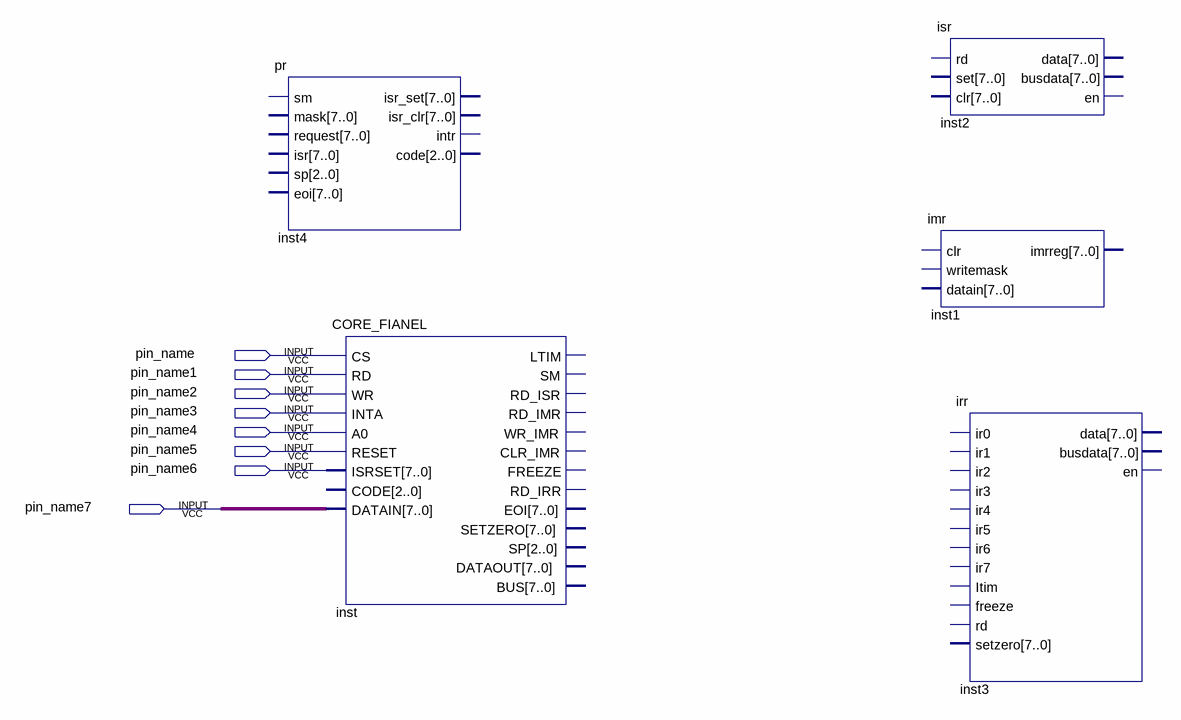
[diagram p0: schematic sheet]
// Quartus schematic 8259A_down.bdf as structural Verilog: 5 symbols, 8 pins
module \8259A_down  (
  input  pin_name,
  input  pin_name1,
  input  pin_name2,
  input  pin_name3,
  input  pin_name4,
  input  pin_name5,
  input  pin_name6,
  input  pin_name7
);

  wire [7:0] undriven;

  pr inst4 ();  // open: sm, mask, request, isr, sp, eoi, isr_set, isr_clr, intr, code
  CORE_FIANEL inst (
    .CS(pin_name), .RD(pin_name1), .WR(pin_name2), .INTA(pin_name3), .A0(pin_name4), .RESET(pin_name5),
    .ISRSET({8{pin_name6}}), .DATAIN(undriven));  // open: CODE, LTIM, SM, RD_ISR, RD_IMR, WR_IMR, CLR_IMR, FREEZE, RD_IRR, EOI, SETZERO, SP, DATAOUT, BUS
  isr inst2 ();  // open: rd, set, clr, data, busdata, en
  imr inst1 ();  // open: clr, writemask, datain, imrreg
  irr inst3 ();  // open: ir0, ir1, ir2, ir3, ir4, ir5, ir6, ir7, Itim, freeze, rd, setzero, data, busdata, en
endmodule
